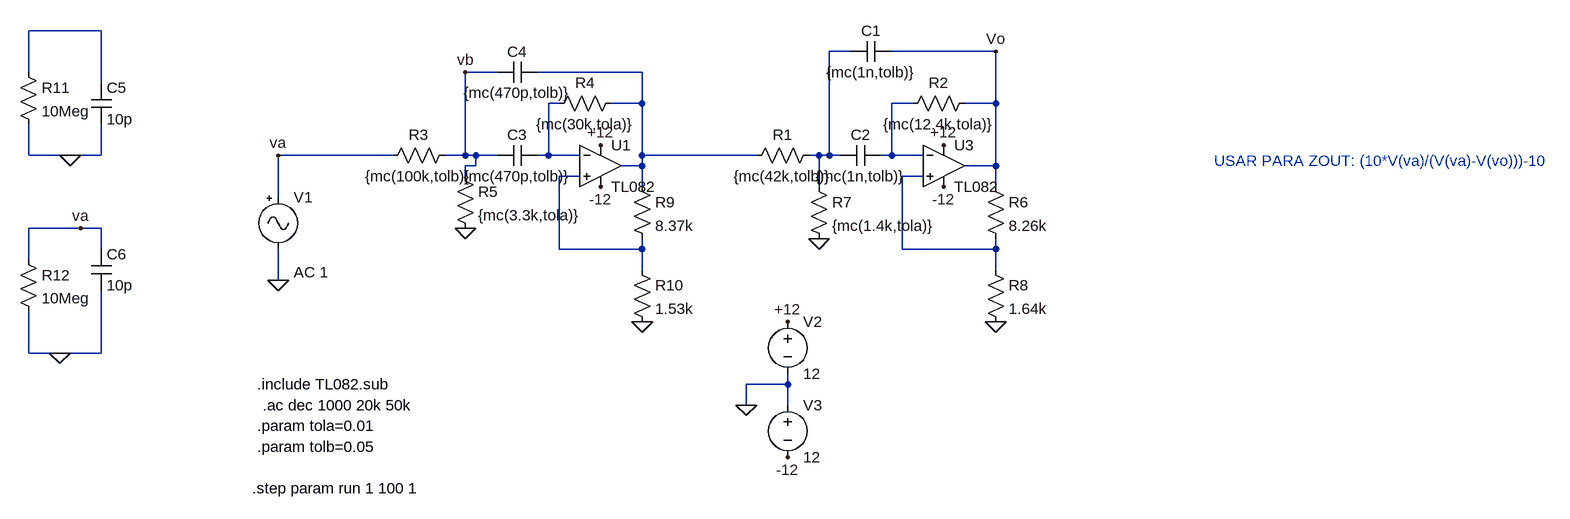
[diagram p0: schematic FiltroPB.asc]
FiltroPB.asc, the LTspice schematic file:
Version 4
SHEET 1 1528 816
WIRE -704 -64 -816 -64
WIRE 448 -32 416 -32
WIRE 672 -32 512 -32
WIRE -816 0 -816 -64
WIRE -96 0 -144 0
WIRE 128 0 -32 0
WIRE -704 16 -704 -64
WIRE 0 48 -16 48
WIRE 128 48 128 0
WIRE 128 48 80 48
WIRE 544 48 512 48
WIRE 672 48 672 -32
WIRE 672 48 624 48
WIRE -816 128 -816 80
WIRE -752 128 -816 128
WIRE -704 128 -704 80
WIRE -704 128 -752 128
WIRE -256 128 -432 128
WIRE -144 128 -144 0
WIRE -144 128 -176 128
WIRE -128 128 -144 128
WIRE -96 128 -128 128
WIRE -16 128 -16 48
WIRE -16 128 -32 128
WIRE 32 128 -16 128
WIRE 128 128 128 48
WIRE 304 128 128 128
WIRE 400 128 384 128
WIRE 416 128 416 -32
WIRE 416 128 400 128
WIRE 432 128 416 128
WIRE 512 128 512 48
WIRE 512 128 496 128
WIRE 560 128 512 128
WIRE -128 144 -128 128
WIRE -128 144 -144 144
WIRE 128 144 128 128
WIRE 128 144 96 144
WIRE 672 144 672 48
WIRE 672 144 624 144
WIRE -144 160 -144 144
WIRE 32 160 0 160
WIRE 560 160 528 160
WIRE 128 176 128 144
WIRE 400 176 400 128
WIRE 672 176 672 144
WIRE -432 192 -432 128
WIRE -736 240 -816 240
WIRE -704 240 -736 240
WIRE -704 272 -704 240
WIRE 0 272 0 160
WIRE 128 272 128 256
WIRE 128 272 0 272
WIRE 528 272 528 160
WIRE 672 272 672 256
WIRE 672 272 528 272
WIRE -816 288 -816 240
WIRE 128 304 128 272
WIRE 672 304 672 272
WIRE -432 320 -432 272
WIRE -816 432 -816 368
WIRE -768 432 -816 432
WIRE -704 432 -704 336
WIRE -704 432 -768 432
WIRE 352 480 352 464
WIRE 352 480 288 480
WIRE 288 512 288 480
WIRE 352 512 352 480
FLAG -432 320 0
FLAG 400 256 0
FLAG -144 240 0
FLAG 672 384 0
FLAG 128 384 0
FLAG 288 512 0
FLAG 352 384 +12
FLAG 592 112 +12
FLAG 64 112 +12
FLAG 352 592 -12
FLAG 592 176 -12
FLAG 64 176 -12
FLAG 672 -32 Vo
FLAG -752 128 0
FLAG -768 432 0
FLAG -736 240 va
FLAG -432 128 va
FLAG -144 0 vb
SYMBOL res 400 112 R90
WINDOW 0 0 56 VBottom 2
WINDOW 3 32 56 VTop 2
SYMATTR InstName R1
SYMATTR Value {mc(42k,tolb)}
SYMBOL res 640 32 R90
WINDOW 0 0 56 VBottom 2
WINDOW 3 32 56 VTop 2
SYMATTR InstName R2
SYMATTR Value {mc(12.4k,tola)}
SYMBOL res -160 112 R90
WINDOW 0 0 56 VBottom 2
WINDOW 3 32 56 VTop 2
SYMATTR InstName R3
SYMATTR Value {mc(100k,tolb)}
SYMBOL res 96 32 R90
WINDOW 0 0 56 VBottom 2
WINDOW 3 32 56 VTop 2
SYMATTR InstName R4
SYMATTR Value {mc(30k,tola)}
SYMBOL cap 512 -48 R90
WINDOW 0 0 32 VBottom 2
WINDOW 3 32 32 VTop 2
SYMATTR InstName C1
SYMATTR Value {mc(1n,tolb)}
SYMBOL cap 496 112 R90
WINDOW 0 0 32 VBottom 2
WINDOW 3 32 32 VTop 2
SYMATTR InstName C2
SYMATTR Value {mc(1n,tolb)}
SYMBOL cap -32 112 R90
WINDOW 0 0 32 VBottom 2
WINDOW 3 32 32 VTop 2
SYMATTR InstName C3
SYMATTR Value {mc(470p,tolb)}
SYMBOL cap -32 -16 R90
WINDOW 0 0 32 VBottom 2
WINDOW 3 32 32 VTop 2
SYMATTR InstName C4
SYMATTR Value {mc(470p,tolb)}
SYMBOL Misc\\signal -432 176 R0
WINDOW 123 24 132 Left 2
WINDOW 39 0 0 Left 2
WINDOW 3 24 44 Left 2
SYMATTR Value2 AC 1
SYMATTR Value ""
SYMATTR InstName V1
SYMBOL res 384 160 R0
SYMATTR InstName R7
SYMATTR Value {mc(1.4k,tola)}
SYMBOL res -160 144 R0
SYMATTR InstName R5
SYMATTR Value {mc(3.3k,tola)}
SYMBOL res 656 160 R0
SYMATTR InstName R6
SYMATTR Value 8.26k
SYMBOL res 656 288 R0
SYMATTR InstName R8
SYMATTR Value 1.64k
SYMBOL res 112 160 R0
SYMATTR InstName R9
SYMATTR Value 8.37k
SYMBOL res 112 288 R0
SYMATTR InstName R10
SYMATTR Value 1.53k
SYMBOL Opamps\\opamp2 64 80 R0
SYMATTR InstName U1
SYMATTR Value TL082
SYMBOL Opamps\\opamp2 592 80 R0
SYMATTR InstName U3
SYMATTR Value TL082
SYMBOL voltage 352 368 R0
WINDOW 123 0 0 Left 2
WINDOW 39 0 0 Left 2
SYMATTR InstName V2
SYMATTR Value 12
SYMBOL voltage 352 496 R0
WINDOW 123 0 0 Left 2
WINDOW 39 0 0 Left 2
SYMATTR InstName V3
SYMATTR Value 12
SYMBOL res -832 -16 R0
SYMATTR InstName R11
SYMATTR Value 10Meg
SYMBOL cap -720 16 R0
SYMATTR InstName C5
SYMATTR Value 10p
SYMBOL res -832 272 R0
SYMATTR InstName R12
SYMATTR Value 10Meg
SYMBOL cap -720 272 R0
SYMATTR InstName C6
SYMATTR Value 10p
TEXT -464 480 Left 2 !.include TL082.sub
TEXT -464 544 Left 2 !.param tola=0.01
TEXT -464 576 Left 2 !.param tolb=0.05
TEXT -456 512 Left 2 !.ac dec 1000 20k 50k
TEXT 1008 136 Left 2 ;USAR PARA ZOUT: (10*V(va)/(V(va)-V(vo)))-10
TEXT -472 640 Left 2 !.step param run 1 100 1

The netlist it stands for:
* FiltroPB.asc
R1 N002 N003 {mc(42k,tolb)}
R2 Vo N005 {mc(12.4k,tola)}
R3 vb va {mc(100k,tolb)}
R4 N003 N004 {mc(30k,tola)}
C1 Vo N002 {mc(1n,tolb)}
C2 N005 N002 {mc(1n,tolb)}
C3 N004 vb {mc(470p,tolb)}
C4 N003 vb {mc(470p,tolb)}
V1 va 0 AC 1
R7 N002 0 {mc(1.4k,tola)}
R5 vb 0 {mc(3.3k,tola)}
R6 Vo N007 8.26k
R8 N007 0 1.64k
R9 N003 N006 8.37k
R10 N006 0 1.53k
XU1 N006 N004 +12 -12 N003 TL082  ; pins In+ In- V+ V- OUT
XU3 N007 N005 +12 -12 Vo TL082  ; pins In+ In- V+ V- OUT
V2 +12 0 12
V3 0 -12 12
R11 N001 0 10Meg
C5 N001 0 10p
R12 va 0 10Meg
C6 va 0 10p
.include TL082.sub
.param tola=0.01
.param tolb=0.05
.ac dec 1000 20k 50k
* USAR PARA ZOUT: (10*V(va)/(V(va)-V(vo)))-10
.step param run 1 100 1
.backanno
.end